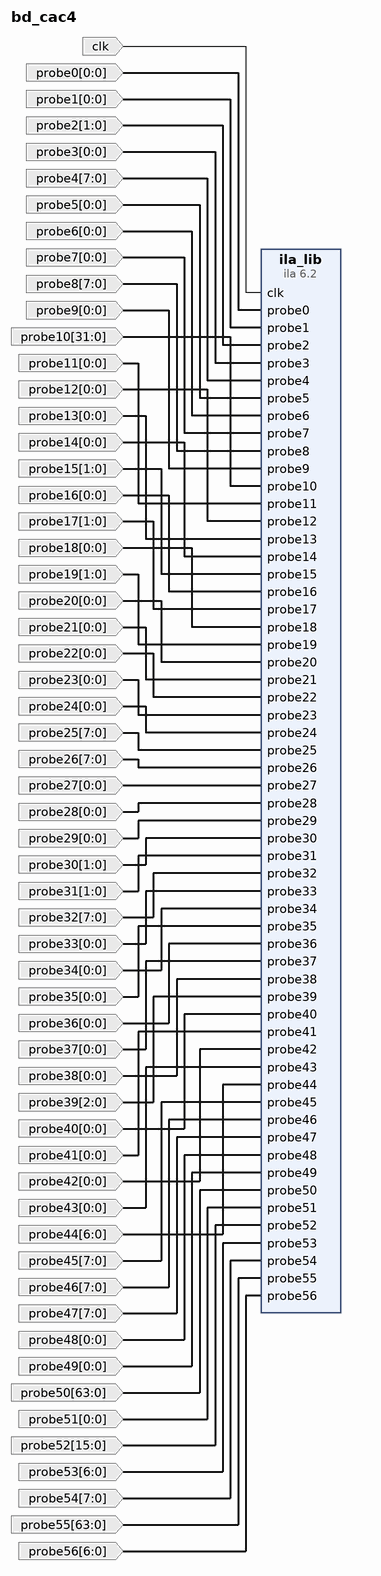
[diagram p0: block diagram of the top level]
# Vivado block design bd_cac4, xc7z100ffg900-1, Vivado 2018.1
create_bd_design bd_cac4

create_bd_port -dir I -type clk clk
create_bd_port -dir I -from 0 -to 0 probe0
create_bd_port -dir I -from 0 -to 0 probe1
create_bd_port -dir I -from 1 -to 0 probe2
create_bd_port -dir I -from 0 -to 0 probe3
create_bd_port -dir I -from 7 -to 0 probe4
create_bd_port -dir I -from 0 -to 0 probe5
create_bd_port -dir I -from 0 -to 0 probe6
create_bd_port -dir I -from 0 -to 0 probe7
create_bd_port -dir I -from 7 -to 0 probe8
create_bd_port -dir I -from 0 -to 0 probe9
create_bd_port -dir I -from 31 -to 0 probe10
create_bd_port -dir I -from 0 -to 0 probe11
create_bd_port -dir I -from 0 -to 0 probe12
create_bd_port -dir I -from 0 -to 0 probe13
create_bd_port -dir I -from 0 -to 0 probe14
create_bd_port -dir I -from 1 -to 0 probe15
create_bd_port -dir I -from 0 -to 0 probe16
create_bd_port -dir I -from 1 -to 0 probe17
create_bd_port -dir I -from 0 -to 0 probe18
create_bd_port -dir I -from 1 -to 0 probe19
create_bd_port -dir I -from 0 -to 0 probe20
create_bd_port -dir I -from 0 -to 0 probe21
create_bd_port -dir I -from 0 -to 0 probe22
create_bd_port -dir I -from 0 -to 0 probe23
create_bd_port -dir I -from 0 -to 0 probe24
create_bd_port -dir I -from 7 -to 0 probe25
create_bd_port -dir I -from 7 -to 0 probe26
create_bd_port -dir I -from 0 -to 0 probe27
create_bd_port -dir I -from 0 -to 0 probe28
create_bd_port -dir I -from 0 -to 0 probe29
create_bd_port -dir I -from 1 -to 0 probe30
create_bd_port -dir I -from 1 -to 0 probe31
create_bd_port -dir I -from 7 -to 0 probe32
create_bd_port -dir I -from 0 -to 0 probe33
create_bd_port -dir I -from 0 -to 0 probe34
create_bd_port -dir I -from 0 -to 0 probe35
create_bd_port -dir I -from 0 -to 0 probe36
create_bd_port -dir I -from 0 -to 0 probe37
create_bd_port -dir I -from 0 -to 0 probe38
create_bd_port -dir I -from 2 -to 0 probe39
create_bd_port -dir I -from 0 -to 0 probe40
create_bd_port -dir I -from 0 -to 0 probe41
create_bd_port -dir I -from 0 -to 0 probe42
create_bd_port -dir I -from 0 -to 0 probe43
create_bd_port -dir I -from 6 -to 0 probe44
create_bd_port -dir I -from 7 -to 0 probe45
create_bd_port -dir I -from 7 -to 0 probe46
create_bd_port -dir I -from 7 -to 0 probe47
create_bd_port -dir I -from 0 -to 0 probe48
create_bd_port -dir I -from 0 -to 0 probe49
create_bd_port -dir I -from 63 -to 0 probe50
create_bd_port -dir I -from 0 -to 0 probe51
create_bd_port -dir I -from 15 -to 0 probe52
create_bd_port -dir I -from 6 -to 0 probe53
create_bd_port -dir I -from 7 -to 0 probe54
create_bd_port -dir I -from 63 -to 0 probe55
create_bd_port -dir I -from 6 -to 0 probe56

create_bd_cell -type ip -vlnv xilinx.com:ip:ila:6.2 ila_lib
set_property -dict [list \
  CONFIG.C_PROBE56_TYPE 0 \
  CONFIG.C_PROBE55_TYPE 0 \
  CONFIG.C_PROBE54_TYPE 0 \
  CONFIG.C_PROBE53_TYPE 0 \
  CONFIG.C_PROBE52_TYPE 0 \
  CONFIG.C_PROBE51_TYPE 0 \
  CONFIG.C_PROBE50_TYPE 0 \
  CONFIG.C_PROBE49_TYPE 0 \
  CONFIG.C_PROBE48_TYPE 0 \
  CONFIG.C_PROBE47_TYPE 0 \
  CONFIG.C_PROBE46_TYPE 0 \
  CONFIG.C_PROBE45_TYPE 0 \
  CONFIG.C_PROBE44_TYPE 0 \
  CONFIG.C_PROBE43_TYPE 0 \
  CONFIG.C_PROBE42_TYPE 0 \
  CONFIG.C_PROBE41_TYPE 0 \
  CONFIG.C_PROBE40_TYPE 0 \
  CONFIG.C_PROBE39_TYPE 0 \
  CONFIG.C_PROBE38_TYPE 0 \
  CONFIG.C_PROBE37_TYPE 0 \
  CONFIG.C_PROBE36_TYPE 0 \
  CONFIG.C_PROBE35_TYPE 0 \
  CONFIG.C_PROBE34_TYPE 0 \
  CONFIG.C_PROBE33_TYPE 0 \
  CONFIG.C_PROBE32_TYPE 0 \
  CONFIG.C_PROBE31_TYPE 0 \
  CONFIG.C_PROBE30_TYPE 0 \
  CONFIG.C_PROBE29_TYPE 0 \
  CONFIG.C_PROBE28_TYPE 0 \
  CONFIG.C_PROBE27_TYPE 0 \
  CONFIG.C_PROBE26_TYPE 0 \
  CONFIG.C_PROBE25_TYPE 0 \
  CONFIG.C_PROBE24_TYPE 0 \
  CONFIG.C_PROBE23_TYPE 0 \
  CONFIG.C_PROBE22_TYPE 0 \
  CONFIG.C_PROBE21_TYPE 0 \
  CONFIG.C_PROBE20_TYPE 0 \
  CONFIG.C_PROBE19_TYPE 0 \
  CONFIG.C_PROBE18_TYPE 0 \
  CONFIG.C_PROBE17_TYPE 0 \
  CONFIG.C_PROBE16_TYPE 0 \
  CONFIG.C_PROBE15_TYPE 0 \
  CONFIG.C_PROBE14_TYPE 0 \
  CONFIG.C_PROBE13_TYPE 0 \
  CONFIG.C_PROBE12_TYPE 0 \
  CONFIG.C_PROBE11_TYPE 0 \
  CONFIG.C_PROBE10_TYPE 0 \
  CONFIG.C_PROBE9_TYPE 0 \
  CONFIG.C_PROBE8_TYPE 0 \
  CONFIG.C_PROBE7_TYPE 0 \
  CONFIG.C_PROBE6_TYPE 0 \
  CONFIG.C_PROBE5_TYPE 0 \
  CONFIG.C_PROBE4_TYPE 0 \
  CONFIG.C_PROBE3_TYPE 0 \
  CONFIG.C_PROBE2_TYPE 0 \
  CONFIG.C_PROBE1_TYPE 0 \
  CONFIG.C_PROBE0_TYPE 0 \
  CONFIG.C_PROBE56_WIDTH 7 \
  CONFIG.C_PROBE55_WIDTH 64 \
  CONFIG.C_PROBE54_WIDTH 8 \
  CONFIG.C_PROBE53_WIDTH 7 \
  CONFIG.C_PROBE52_WIDTH 16 \
  CONFIG.C_PROBE51_WIDTH 1 \
  CONFIG.C_PROBE50_WIDTH 64 \
  CONFIG.C_PROBE49_WIDTH 1 \
  CONFIG.C_PROBE48_WIDTH 1 \
  CONFIG.C_PROBE47_WIDTH 8 \
  CONFIG.C_PROBE46_WIDTH 8 \
  CONFIG.C_PROBE45_WIDTH 8 \
  CONFIG.C_PROBE44_WIDTH 7 \
  CONFIG.C_PROBE43_WIDTH 1 \
  CONFIG.C_PROBE42_WIDTH 1 \
  CONFIG.C_PROBE41_WIDTH 1 \
  CONFIG.C_PROBE40_WIDTH 1 \
  CONFIG.C_PROBE39_WIDTH 1 \
  CONFIG.C_PROBE38_WIDTH 1 \
  CONFIG.C_PROBE37_WIDTH 1 \
  CONFIG.C_PROBE36_WIDTH 1 \
  CONFIG.C_PROBE35_WIDTH 1 \
  CONFIG.C_PROBE34_WIDTH 1 \
  CONFIG.C_PROBE33_WIDTH 1 \
  CONFIG.C_PROBE32_WIDTH 8 \
  CONFIG.C_PROBE31_WIDTH 2 \
  CONFIG.C_PROBE30_WIDTH 2 \
  CONFIG.C_PROBE29_WIDTH 1 \
  CONFIG.C_PROBE28_WIDTH 1 \
  CONFIG.C_PROBE27_WIDTH 1 \
  CONFIG.C_PROBE26_WIDTH 8 \
  CONFIG.C_PROBE25_WIDTH 8 \
  CONFIG.C_PROBE24_WIDTH 1 \
  CONFIG.C_PROBE23_WIDTH 1 \
  CONFIG.C_PROBE22_WIDTH 1 \
  CONFIG.C_PROBE21_WIDTH 1 \
  CONFIG.C_PROBE20_WIDTH 1 \
  CONFIG.C_PROBE19_WIDTH 2 \
  CONFIG.C_PROBE18_WIDTH 1 \
  CONFIG.C_PROBE17_WIDTH 2 \
  CONFIG.C_PROBE16_WIDTH 1 \
  CONFIG.C_PROBE15_WIDTH 2 \
  CONFIG.C_PROBE14_WIDTH 1 \
  CONFIG.C_PROBE13_WIDTH 1 \
  CONFIG.C_PROBE12_WIDTH 1 \
  CONFIG.C_PROBE11_WIDTH 1 \
  CONFIG.C_PROBE10_WIDTH 1 \
  CONFIG.C_PROBE9_WIDTH 1 \
  CONFIG.C_PROBE8_WIDTH 8 \
  CONFIG.C_PROBE7_WIDTH 1 \
  CONFIG.C_PROBE6_WIDTH 1 \
  CONFIG.C_PROBE5_WIDTH 1 \
  CONFIG.C_PROBE4_WIDTH 8 \
  CONFIG.C_PROBE3_WIDTH 1 \
  CONFIG.C_PROBE2_WIDTH 2 \
  CONFIG.C_PROBE1_WIDTH 1 \
  CONFIG.C_PROBE0_WIDTH 1 \
  CONFIG.C_DATA_DEPTH 32768 \
  CONFIG.C_NUM_OF_PROBES 57 \
  CONFIG.C_XLNX_HW_PROBE_INFO DEFAULT \
  CONFIG.C_TRIGOUT_EN false \
  CONFIG.C_EN_STRG_QUAL 0 \
  CONFIG.C_EN_TIME_TAG 0 \
  CONFIG.C_TIME_TAG_WIDTH 32 \
  CONFIG.C_INPUT_PIPE_STAGES 0 \
  CONFIG.C_ILA_CLK_FREQ 59994000 \
  CONFIG.C_ADV_TRIGGER FALSE \
  CONFIG.C_PROBE56_MU_CNT 1 \
  CONFIG.C_PROBE55_MU_CNT 1 \
  CONFIG.C_PROBE54_MU_CNT 1 \
  CONFIG.C_PROBE53_MU_CNT 1 \
  CONFIG.C_PROBE52_MU_CNT 1 \
  CONFIG.C_PROBE51_MU_CNT 1 \
  CONFIG.C_PROBE50_MU_CNT 1 \
  CONFIG.C_PROBE49_MU_CNT 1 \
  CONFIG.C_PROBE48_MU_CNT 1 \
  CONFIG.C_PROBE47_MU_CNT 1 \
  CONFIG.C_PROBE46_MU_CNT 1 \
  CONFIG.C_PROBE45_MU_CNT 1 \
  CONFIG.C_PROBE44_MU_CNT 1 \
  CONFIG.C_PROBE43_MU_CNT 1 \
  CONFIG.C_PROBE42_MU_CNT 1 \
  CONFIG.C_PROBE41_MU_CNT 1 \
  CONFIG.C_PROBE40_MU_CNT 1 \
  CONFIG.C_PROBE39_MU_CNT 1 \
  CONFIG.C_PROBE38_MU_CNT 1 \
  CONFIG.C_PROBE37_MU_CNT 1 \
  CONFIG.C_PROBE36_MU_CNT 1 \
  CONFIG.C_PROBE35_MU_CNT 1 \
  CONFIG.C_PROBE34_MU_CNT 1 \
  CONFIG.C_PROBE33_MU_CNT 1 \
  CONFIG.C_PROBE32_MU_CNT 1 \
  CONFIG.C_PROBE31_MU_CNT 1 \
  CONFIG.C_PROBE30_MU_CNT 1 \
  CONFIG.C_PROBE29_MU_CNT 1 \
  CONFIG.C_PROBE28_MU_CNT 1 \
  CONFIG.C_PROBE27_MU_CNT 1 \
  CONFIG.C_PROBE26_MU_CNT 1 \
  CONFIG.C_PROBE25_MU_CNT 1 \
  CONFIG.C_PROBE24_MU_CNT 1 \
  CONFIG.C_PROBE23_MU_CNT 1 \
  CONFIG.C_PROBE22_MU_CNT 1 \
  CONFIG.C_PROBE21_MU_CNT 1 \
  CONFIG.C_PROBE20_MU_CNT 1 \
  CONFIG.C_PROBE19_MU_CNT 1 \
  CONFIG.C_PROBE18_MU_CNT 1 \
  CONFIG.C_PROBE17_MU_CNT 1 \
  CONFIG.C_PROBE16_MU_CNT 1 \
  CONFIG.C_PROBE15_MU_CNT 1 \
  CONFIG.C_PROBE14_MU_CNT 1 \
  CONFIG.C_PROBE13_MU_CNT 1 \
  CONFIG.C_PROBE12_MU_CNT 1 \
  CONFIG.C_PROBE11_MU_CNT 1 \
  CONFIG.C_PROBE10_MU_CNT 1 \
  CONFIG.C_PROBE9_MU_CNT 1 \
  CONFIG.C_PROBE8_MU_CNT 1 \
  CONFIG.C_PROBE7_MU_CNT 1 \
  CONFIG.C_PROBE6_MU_CNT 1 \
  CONFIG.C_PROBE5_MU_CNT 1 \
  CONFIG.C_PROBE4_MU_CNT 1 \
  CONFIG.C_PROBE3_MU_CNT 1 \
  CONFIG.C_PROBE2_MU_CNT 1 \
  CONFIG.C_PROBE1_MU_CNT 1 \
  CONFIG.C_PROBE0_MU_CNT 1 \
  CONFIG.C_TRIGIN_EN false \
  CONFIG.ALL_PROBE_SAME_MU TRUE \
  CONFIG.ALL_PROBE_SAME_MU_CNT 1 \
  CONFIG.C_MONITOR_TYPE Native \
] [get_bd_cells ila_lib]

# ---- connections ----

connect_bd_net [get_bd_ports clk] [get_bd_pins ila_lib/clk]
connect_bd_net -net probe0_1 [get_bd_ports probe0] [get_bd_pins ila_lib/probe0]
connect_bd_net -net probe1_1 [get_bd_ports probe1] [get_bd_pins ila_lib/probe1]
connect_bd_net -net probe2_1 [get_bd_ports probe2] [get_bd_pins ila_lib/probe2]
connect_bd_net -net probe3_1 [get_bd_ports probe3] [get_bd_pins ila_lib/probe3]
connect_bd_net -net probe4_1 [get_bd_ports probe4] [get_bd_pins ila_lib/probe4]
connect_bd_net -net probe5_1 [get_bd_ports probe5] [get_bd_pins ila_lib/probe5]
connect_bd_net -net probe6_1 [get_bd_ports probe6] [get_bd_pins ila_lib/probe6]
connect_bd_net -net probe7_1 [get_bd_ports probe7] [get_bd_pins ila_lib/probe7]
connect_bd_net -net probe8_1 [get_bd_ports probe8] [get_bd_pins ila_lib/probe8]
connect_bd_net -net probe9_1 [get_bd_ports probe9] [get_bd_pins ila_lib/probe9]
connect_bd_net -net probe10_1 [get_bd_ports probe10] [get_bd_pins ila_lib/probe10]
connect_bd_net -net probe11_1 [get_bd_ports probe11] [get_bd_pins ila_lib/probe11]
connect_bd_net -net probe12_1 [get_bd_ports probe12] [get_bd_pins ila_lib/probe12]
connect_bd_net -net probe13_1 [get_bd_ports probe13] [get_bd_pins ila_lib/probe13]
connect_bd_net -net probe14_1 [get_bd_ports probe14] [get_bd_pins ila_lib/probe14]
connect_bd_net -net probe15_1 [get_bd_ports probe15] [get_bd_pins ila_lib/probe15]
connect_bd_net -net probe16_1 [get_bd_ports probe16] [get_bd_pins ila_lib/probe16]
connect_bd_net -net probe17_1 [get_bd_ports probe17] [get_bd_pins ila_lib/probe17]
connect_bd_net -net probe18_1 [get_bd_ports probe18] [get_bd_pins ila_lib/probe18]
connect_bd_net -net probe19_1 [get_bd_ports probe19] [get_bd_pins ila_lib/probe19]
connect_bd_net -net probe20_1 [get_bd_ports probe20] [get_bd_pins ila_lib/probe20]
connect_bd_net -net probe21_1 [get_bd_ports probe21] [get_bd_pins ila_lib/probe21]
connect_bd_net -net probe22_1 [get_bd_ports probe22] [get_bd_pins ila_lib/probe22]
connect_bd_net -net probe23_1 [get_bd_ports probe23] [get_bd_pins ila_lib/probe23]
connect_bd_net -net probe24_1 [get_bd_ports probe24] [get_bd_pins ila_lib/probe24]
connect_bd_net -net probe25_1 [get_bd_ports probe25] [get_bd_pins ila_lib/probe25]
connect_bd_net -net probe26_1 [get_bd_ports probe26] [get_bd_pins ila_lib/probe26]
connect_bd_net -net probe27_1 [get_bd_ports probe27] [get_bd_pins ila_lib/probe27]
connect_bd_net -net probe28_1 [get_bd_ports probe28] [get_bd_pins ila_lib/probe28]
connect_bd_net -net probe29_1 [get_bd_ports probe29] [get_bd_pins ila_lib/probe29]
connect_bd_net -net probe30_1 [get_bd_ports probe30] [get_bd_pins ila_lib/probe30]
connect_bd_net -net probe31_1 [get_bd_ports probe31] [get_bd_pins ila_lib/probe31]
connect_bd_net -net probe32_1 [get_bd_ports probe32] [get_bd_pins ila_lib/probe32]
connect_bd_net -net probe33_1 [get_bd_ports probe33] [get_bd_pins ila_lib/probe33]
connect_bd_net -net probe34_1 [get_bd_ports probe34] [get_bd_pins ila_lib/probe34]
connect_bd_net -net probe35_1 [get_bd_ports probe35] [get_bd_pins ila_lib/probe35]
connect_bd_net -net probe36_1 [get_bd_ports probe36] [get_bd_pins ila_lib/probe36]
connect_bd_net -net probe37_1 [get_bd_ports probe37] [get_bd_pins ila_lib/probe37]
connect_bd_net -net probe38_1 [get_bd_ports probe38] [get_bd_pins ila_lib/probe38]
connect_bd_net -net probe39_1 [get_bd_ports probe39] [get_bd_pins ila_lib/probe39]
connect_bd_net -net probe40_1 [get_bd_ports probe40] [get_bd_pins ila_lib/probe40]
connect_bd_net -net probe41_1 [get_bd_ports probe41] [get_bd_pins ila_lib/probe41]
connect_bd_net -net probe42_1 [get_bd_ports probe42] [get_bd_pins ila_lib/probe42]
connect_bd_net -net probe43_1 [get_bd_ports probe43] [get_bd_pins ila_lib/probe43]
connect_bd_net -net probe44_1 [get_bd_ports probe44] [get_bd_pins ila_lib/probe44]
connect_bd_net -net probe45_1 [get_bd_ports probe45] [get_bd_pins ila_lib/probe45]
connect_bd_net -net probe46_1 [get_bd_ports probe46] [get_bd_pins ila_lib/probe46]
connect_bd_net -net probe47_1 [get_bd_ports probe47] [get_bd_pins ila_lib/probe47]
connect_bd_net -net probe48_1 [get_bd_ports probe48] [get_bd_pins ila_lib/probe48]
connect_bd_net -net probe49_1 [get_bd_ports probe49] [get_bd_pins ila_lib/probe49]
connect_bd_net -net probe50_1 [get_bd_ports probe50] [get_bd_pins ila_lib/probe50]
connect_bd_net -net probe51_1 [get_bd_ports probe51] [get_bd_pins ila_lib/probe51]
connect_bd_net -net probe52_1 [get_bd_ports probe52] [get_bd_pins ila_lib/probe52]
connect_bd_net -net probe53_1 [get_bd_ports probe53] [get_bd_pins ila_lib/probe53]
connect_bd_net -net probe54_1 [get_bd_ports probe54] [get_bd_pins ila_lib/probe54]
connect_bd_net -net probe55_1 [get_bd_ports probe55] [get_bd_pins ila_lib/probe55]
connect_bd_net -net probe56_1 [get_bd_ports probe56] [get_bd_pins ila_lib/probe56]

validate_bd_design
save_bd_design
